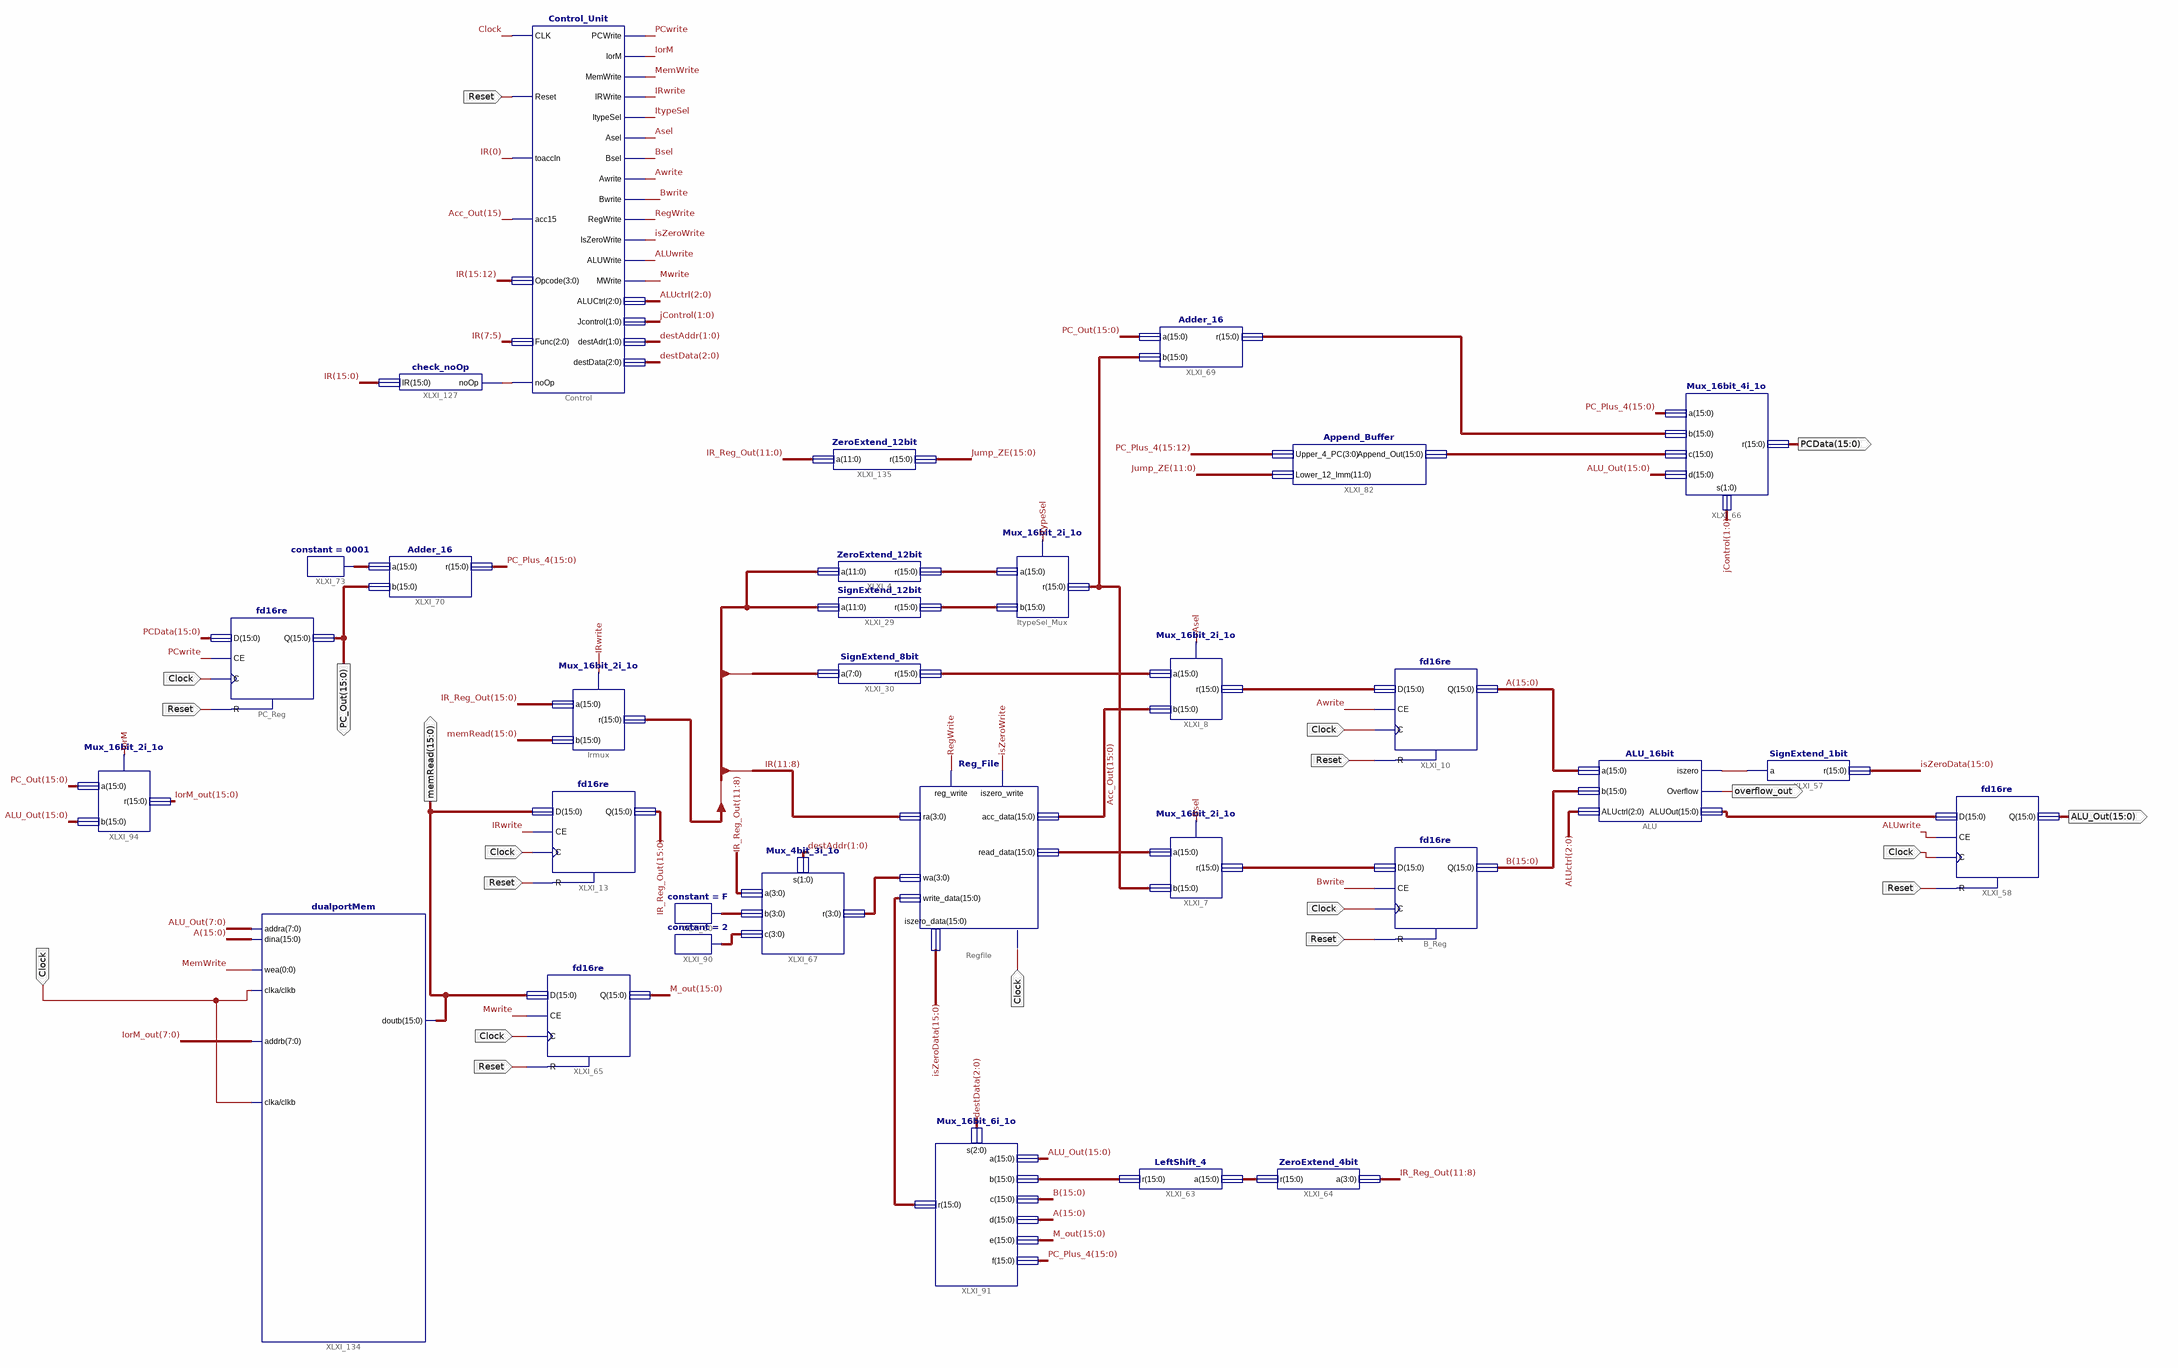
[diagram p0: schematic sheet 1]
// Xilinx ISE schematic Processor_Integration_7.sch (spartan3e) as structural Verilog: 32 symbols, 7 ports
module Processor_Integration_7 (
  input  Clock,
  input  Reset,
  output [15:0] PCData,
  output [15:0] PC_Out,
  output [15:0] memRead,
  output [15:0] ALU_Out,
  output overflow_out
);

  wire ALUwrite, Asel, Awrite, Bsel, Bwrite, IorM, IRwrite, isZero, isZeroWrite, ItypeSel, MemWrite, Mwrite,
       PCwrite, RegWrite, XLXN_332;
  wire [1:0] destAddr, jControl;
  wire [2:0] ALUctrl, destData;
  wire [3:0] write_address, XLXN_147, XLXN_169;
  wire [15:0] A, Acc_Out, ALU_output, append, B, IorM_out, IR, IR_Reg_Out, isZeroData, Jump_ZE, M_out,
       PC_Plus_4, r_out, XLXN_56, XLXN_98, XLXN_101, XLXN_130, XLXN_131, XLXN_152, XLXN_156, XLXN_177,
       XLXN_188, XLXN_333, XLXN_346;

  Reg_File Regfile (
    .clock(Clock), .reg_write(RegWrite), .iszero_write(isZeroWrite), .ra(IR[11:8]), .wa(write_address),
    .write_data(XLXN_346), .iszero_data(isZeroData), .acc_data(Acc_Out), .read_data(XLXN_98));
  SignExtend_12bit XLXI_29 (.a(IR[11:0]), .r(XLXN_333));
  ZeroExtend_12bit XLXI_4 (.a(IR[11:0]), .r(XLXN_56));
  SignExtend_8bit XLXI_30 (.a(IR[7:0]), .r(XLXN_101));
  Mux_16bit_2i_1o ItypeSel_Mux (.b(XLXN_333), .r(r_out), .s(ItypeSel), .a(XLXN_56));
  Mux_16bit_2i_1o XLXI_7 (.b(r_out), .r(XLXN_131), .s(Bsel), .a(XLXN_98));
  Mux_16bit_2i_1o XLXI_8 (.b(Acc_Out), .r(XLXN_130), .s(Asel), .a(XLXN_101));
  fd16re B_Reg (.C(Clock), .CE(Bwrite), .D(XLXN_131), .R(Reset), .Q(B));
  fd16re XLXI_10 (.C(Clock), .CE(Awrite), .D(XLXN_130), .R(Reset), .Q(A));
  ALU_16bit ALU (.a(A), .b(B), .ALUctrl(ALUctrl), .iszero(isZero), .Overflow(overflow_out), .ALUOut(ALU_output));
  SignExtend_1bit XLXI_57 (.a(isZero), .r(isZeroData));
  fd16re XLXI_13 (.C(Clock), .CE(IRwrite), .D(memRead), .R(Reset), .Q(IR_Reg_Out));
  LeftShift_4 XLXI_63 (.a(XLXN_156), .r(XLXN_152));
  ZeroExtend_4bit XLXI_64 (.a(IR_Reg_Out[11:8]), .r(XLXN_156));
  fd16re XLXI_65 (.C(Clock), .CE(Mwrite), .D(memRead), .R(Reset), .Q(M_out));
  fd16re XLXI_58 (.C(Clock), .CE(ALUwrite), .D(ALU_output), .R(Reset), .Q(ALU_Out));
  Mux_16bit_4i_1o XLXI_66 (.a(PC_Plus_4), .b(XLXN_177), .c(append), .d(ALU_Out), .r(PCData), .s(jControl));
  Adder_16 XLXI_69 (.a(PC_Out), .b(r_out), .r(XLXN_177));
  fd16re PC_Reg (.C(Clock), .CE(PCwrite), .D(PCData), .R(Reset), .Q(PC_Out));
  Adder_16 XLXI_70 (.a(XLXN_188), .b(PC_Out), .r(PC_Plus_4));
  constant #(.CValue("0001")) XLXI_73 (.O(XLXN_188));
  Append_Buffer XLXI_82 (.Upper_4_PC(PC_Plus_4[15:12]), .Lower_12_Imm(Jump_ZE[11:0]), .Append_Out(append));
  Mux_4bit_3i_1o XLXI_67 (.s(destAddr), .r(write_address), .a(IR_Reg_Out[11:8]), .b(XLXN_147), .c(XLXN_169));
  constant #(.CValue("F")) XLXI_60 (.O(XLXN_147));
  constant #(.CValue("2")) XLXI_90 (.O(XLXN_169));
  Mux_16bit_6i_1o XLXI_91 (
    .s(destData), .r(XLXN_346), .a(ALU_Out), .b(XLXN_152), .c(B), .d(A), .e(M_out), .f(PC_Plus_4));
  Mux_16bit_2i_1o XLXI_94 (.b(ALU_Out), .r(IorM_out), .s(IorM), .a(PC_Out));
  Control_Unit Control (
    .CLK(Clock), .Reset(Reset), .toaccIn(IR[0]), .acc15(Acc_Out[15]), .Opcode(IR[15:12]), .Func(IR[7:5]),
    .PCWrite(PCwrite), .IorM(IorM), .MemWrite(MemWrite), .IRWrite(IRwrite), .ItypeSel(ItypeSel), .Asel(Asel),
    .Bsel(Bsel), .Awrite(Awrite), .Bwrite(Bwrite), .RegWrite(RegWrite), .IsZeroWrite(isZeroWrite),
    .ALUWrite(ALUwrite), .MWrite(Mwrite), .ALUCtrl(ALUctrl), .Jcontrol(jControl), .destAdr(destAddr),
    .destData(destData), .noOp(XLXN_332));
  check_noOp XLXI_127 (.noOp(XLXN_332), .IR(IR));
  Mux_16bit_2i_1o Irmux (.b(memRead), .r(IR), .s(IRwrite), .a(IR_Reg_Out));
  dualportMem XLXI_134 (
    .addra(ALU_Out[7:0]), .dina(A), .wea(MemWrite), .clka(Clock), .addrb(IorM_out[7:0]), .clkb(Clock),
    .doutb(memRead));
  ZeroExtend_12bit XLXI_135 (.a(IR_Reg_Out[11:0]), .r(Jump_ZE));
endmodule
